# Altium schematic sheet INERTIAL.SchDoc: IMU
size A4; ApprovedBy: Yves Chevallier; CheckedBy: Yves Chevallier; Author: Yves Chevallier; CompanyName: EPFL; DrawnBy: Yves Chevallier; Engineer: Yves Chevallier; Organization: EPFL; Address1: EPFL; Address2: CH1015 Lausanne; Address3: +41(0)21 693 36 98; Address4: +41(0)21 693 26 00; DocumentNumber: ABC.00.0000.000.0; Revision: v1.0; SheetNumber: 0; SheetTotal: 0; DrawnByDate: 2000-01-01; ExecutionWarrantDate: 2000-01-01; ExecutionWarrant: Yves Chevallier; Context: Confidential; PageSetup: Record=PageOptions|CenterHorizontal=True|CenterVertical=False|PrintScale=0.97|XCorrection=1.00|YCorrection=1.00|PrintKind=0|BorderSize=5000000|LeftOffset=0|BottomOffset=0|Orientation=2|PaperLength=1000|PaperWidth=1000|Scale=100|PaperSource=262|PrintQuality=600|MediaType=1|DitherType=10|PaperKind=A4|PrintScaleMode=1; EngineerDate: 2000-01-01; CheckedByDate: 2000-01-01; ProjectName: PRJ
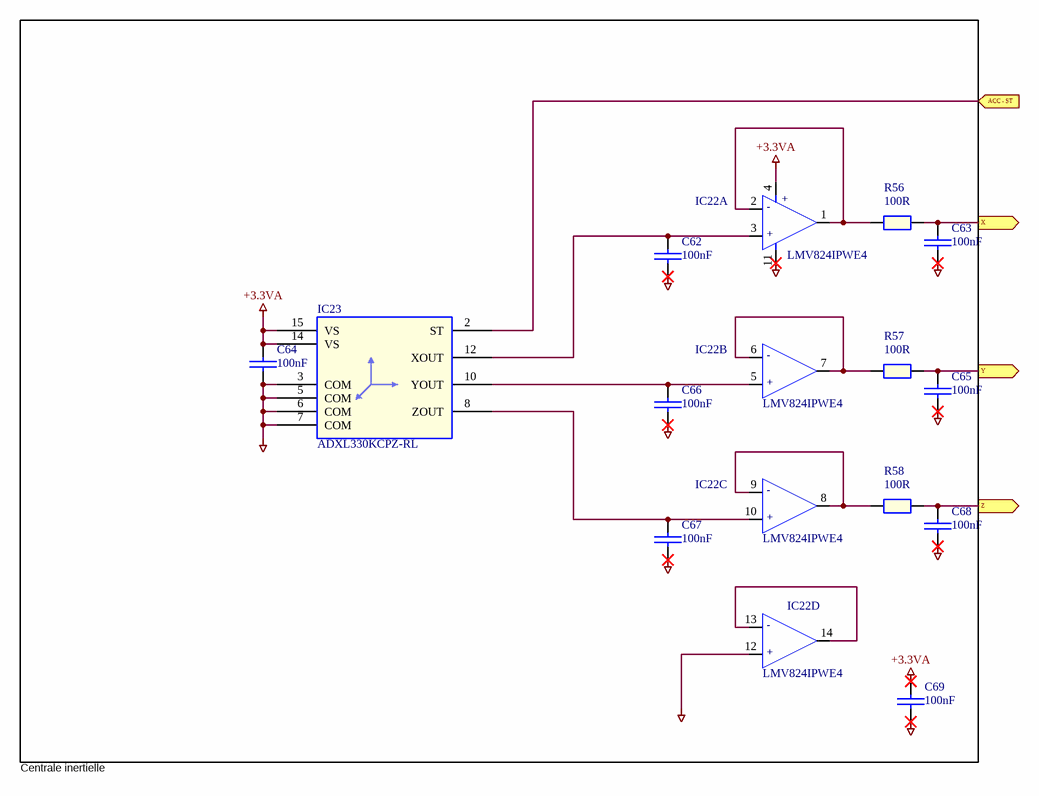
[diagram p0: INERTIAL.SchDoc]

## Parts
C62  100nF  [SM/C_0805]
C63  100nF  [SM/C_0805]
C64  100nF  [SM/C_0805]
C65  100nF  [SM/C_0805]
C66  100nF  [SM/C_0805]
C67  100nF  [SM/C_0805]
C68  100nF  [SM/C_0805]
C69  100nF  [SM/C_0805]
IC22  LMV824IPWE4  [HEIG/SM/TSSOP14]  (parts A,B,C,D of 4)
IC23  ADXL330KCPZ-RL  [HEIG/IC/ADXL330]
R56  100R  [R400]
R57  100R  [R400]
R58  100R  [R400]

## Ports
ACC - ST (in), X (out), Y (out), Z (out)

## Nets
+3.3VA: C64.1 C69.1 IC22.4(V+) IC23.14(VS) IC23.15(VS)
AGND: C62.2 C63.2 C64.2 C65.2 C66.2 C67.2 C68.2 C69.2 IC22.11(V-) IC22.12(+IN_D) IC23.3(COM) IC23.5(COM) IC23.6(COM) IC23.7(COM)
ACC - ST: IC23.2(ST) ; port ACC - ST
X: C63.1 R56.2 ; port X
Y: C65.1 R57.2 ; port Y
Z: C68.1 R58.2 ; port Z
NetC62_1: C62.1 IC22.3(+IN_A) IC23.12(XOUT)
NetC66_1: C66.1 IC22.5(+IN_B) IC23.10(YOUT)
NetC67_1: C67.1 IC22.10(+IN_C) IC23.8(ZOUT)
NetIC22_1: IC22.1(OUT_A) IC22.2(-IN_A) R56.1
NetIC22_6: IC22.6(-IN_B) IC22.7(OUT_B) R57.1
NetIC22_8: IC22.8(OUT_C) IC22.9(-IN_C) R58.1
NetIC22_13: IC22.13(-IN_D) IC22.14(OUT_D)

## Notes on the sheet
- Centrale inertielle
- HES-SO / HEIG-VD / TIN / IAI
  Route de Cheseaux, 1
  CH-1401 Yverdon-les-Bains
  T +41 24 557 73 77    F +41 24 557 63 20
  http://iai.heig-vd.ch
  iai@heig-vd.ch
- Title
- Size
- Date
- A4
- Project
- Sheet
- of
- No.
- Author
- SVN/Git
- Version
- File
- (in symbol AD8609_0, part A) +; -
- (in symbol AD8609_0, part B) -; +
- (in symbol AD8609_0, part C) -; +
- (in symbol AD8609_0, part D) -; +

## Library data of the parts
C62 C63 C65-C67 C69 = C_Dup1: Prix Unitaire: 0.14; Référence: 499-687; Ref. Fab: AVX; Prix: 0.06; Ref. Fabricant: 2238 786 15649; Fabricant: PHYCOMP; Quantité min: 10; PCB Footprint: HEIG/SM/C_0603; Distributor: Farnell; Ref. Distributor: 499-687; Price in €: 0.140; Distributeur: Farnell; Ref. Distributeur: 432210
C64 C68 = C_Dup1: Quantité min: 10; Fabricant: PHYCOMP; Ref. Fabricant: 2238 786 15649; Prix: 0.06; Ref. Fab: AVX; Référence: 499-687; Prix Unitaire: 0.14; PCB Footprint: HEIG/SM/C_0603; Ref. Distributeur: 432210; Distributeur: Farnell; Price in €: 0.140; Ref. Distributor: 499-687; Distributor: Farnell
IC22 = AD8609_0: Prix: 1.90; Quantité min: 1; Fabricant: TEXAS INSTRUMENTS; PCB Footprint: HEIG/SM/TSSOP14; Distributeur: Farnell; Ref. Distributeur: 1053727; Ref. Fabricant: LMV824IPWE4
IC23 = ADXL330: Quantité min: 1; Prix: 23; Fabricant: ANALOG DEVICES; Distributeur: Farnell; Ref. Distributeur: 1274125; Ref. Fabricant: ADXL330KCPZ-RL; PCB Footprint: HEIG/IC/ADXL330
R56-R58 = R_Dup1: Quantité min: 50; Prix: 0.113; Ref. Fabricant: 232270260101; Fabricant: PHYCOMP; PCB Footprint: HEIG/SM/R_0603; Distributeur: Farnell; Ref. Distributeur: 9233253